# EAGLE design sw-4416-project-v1 (EAGLE 6.2)
ECE 4416 Design Project: Wireless Control Utilizing Head Movement
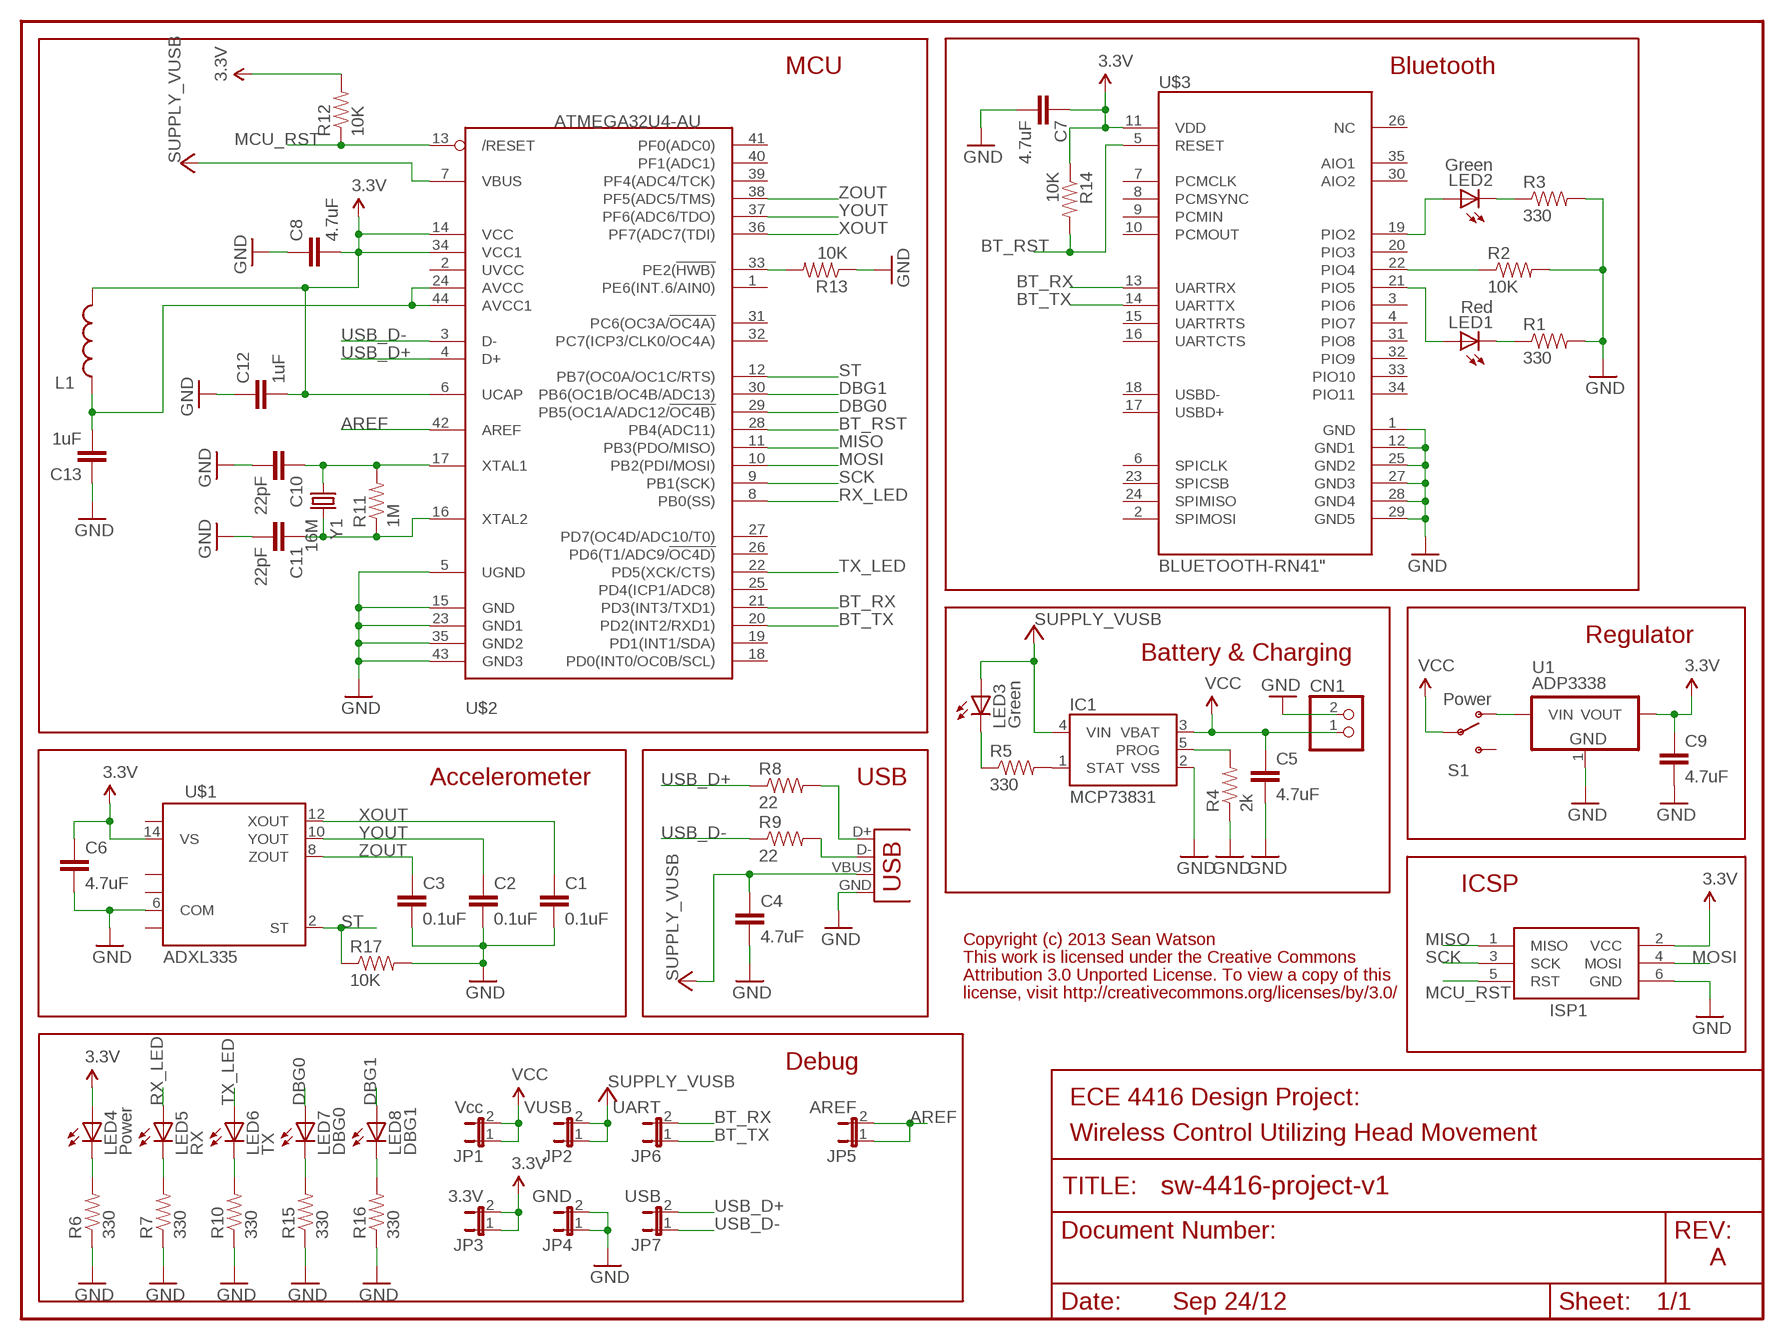
[diagram p0: schematic, sheet 1]
FRAME1 (FRAME-LETTER): LAST_DATE_TIME: Sep 20/12

## Parts
C1  0.1uF  CAP0603-CAP  [0603-CAP]
C2  0.1uF  CAP0603-CAP  [0603-CAP]
C3  0.1uF  CAP0603-CAP  [0603-CAP]
C4  4.7uF  CAP0603-CAP  [0603-CAP]
C5  4.7uF  CAP0603-CAP  [0603-CAP]
C6  4.7uF  CAP0603-CAP  [0603-CAP]
C7  4.7uF  CAP0603-CAP  [0603-CAP]
C8  4.7uF  CAP0603-CAP  [0603-CAP]
C9  4.7uF  CAP0603-CAP  [0603-CAP]
C10  22pF  CAP0603-CAP  [0603-CAP]
C11  22pF  CAP0603-CAP  [0603-CAP]
C12  1uF  CAP0603-CAP  [0603-CAP]
C13  1uF  CAP0603-CAP  [0603-CAP]
CN1  JST_2PIN-SMT-RA  [JST-PH-2-SMT-RA]
IC1  MCP73831  [SOT23-5]
ISP1  AVRISP-6  [AVRISP]
JP1  Vcc  JUMPER-2PTH  [1X02]
JP2  VUSB  JUMPER-2PTH  [1X02]
JP3  3.3V  JUMPER-2PTH  [1X02]
JP4  GND  JUMPER-2PTH  [1X02]
JP5  AREF  JUMPER-2PTH  [1X02]
JP6  UART  JUMPER-2PTH  [1X02]
JP7  USB  JUMPER-2PTH  [1X02]
L1  INDUCTOR0805  [0805]
LED1  Red  LED0603  [LED-0603]
LED2  Green  LED0603  [LED-0603]
LED3  Green  LED0603  [LED-0603]
LED4  Power  LED0603  [LED-0603]
LED5  RX  LED0603  [LED-0603]
LED6  TX  LED0603  [LED-0603]
LED7  DBG0  LED0603  [LED-0603]
LED8  DBG1  LED0603  [LED-0603]
R1  330  RESISTOR0603-RES  [0603-RES]
R2  10K  RESISTOR0603-RES  [0603-RES]
R3  330  RESISTOR0603-RES  [0603-RES]
R4  2k  RESISTOR0603-RES  [0603-RES]
R5  330  RESISTOR0603-RES  [0603-RES]
R6  330  RESISTOR0603-RES  [0603-RES]
R7  330  RESISTOR0603-RES  [0603-RES]
R8  22  RESISTOR0603-RES  [0603-RES]
R9  22  RESISTOR0603-RES  [0603-RES]
R10  330  RESISTOR0603-RES  [0603-RES]
R11  1M  RESISTOR0603-RES  [0603-RES]
R12  10K  RESISTOR0603-RES  [0603-RES]
R13  10K  RESISTOR0603-RES  [0603-RES]
R14  10K  RESISTOR0603-RES  [0603-RES]
R15  330  RESISTOR0603-RES  [0603-RES]
R16  330  RESISTOR0603-RES  [0603-RES]
R17  10K  RESISTOR0603-RES  [0603-RES]
S1  Power  SWITCH-SPST-SMD-A  [SWITCH-SPST-SMD-A]
U1  ADP3338  VREG_3PINS-SOT-223  [SOT-223]
U$1  ADXL335  [LFCSP-16]
U$2  ATMEGA32U4-AU  [TQFP44]
U$3  BLUETOOTH-RN41"  [RN41]
X1  USB-MICROB  [USB-MICROB]
Y1  16M  CRYSTALHC49US  [HC49US]

## Nets
3.3V: C6.1 C7.1 C8.2 C9.1 C12.2 ISP1.2(VCC) JP3.1 JP3.2 L1.2 LED4.A R12.2 R14.1 U1.2(VOUT) U$1.14(VS) U$2.6(UCAP) U$2.14(VCC) U$2.34(VCC1) U$3.11(VDD)
AREF: JP5.1 JP5.2 U$2.42(AREF)
BT_RST: R14.2 U$2.28(PB4(ADC11)) U$3.5(RESET)
BT_RX: JP6.2 U$2.21(PD3(INT3/TXD1)) U$3.13(UARTRX)
BT_TX: JP6.1 U$2.20(PD2(INT2/RXD1)) U$3.14(UARTTX)
DBG0: LED7.A U$2.29(PB5(OC1A/ADC12/!OC4B))
DBG1: LED8.A U$2.30(PB6(OC1B/OC4B/ADC13))
GND: C1.2 C2.2 C3.2 C4.2 C5.2 C6.2 C7.2 C8.1 C9.2 C10.2 C11.2 C12.1 C13.1 CN1.2 IC1.2(VSS) ISP1.6(GND) JP4.1 JP4.2 R1.2 R2.2 R3.2 R4.1 R6.1 R7.1 R10.1 R13.1 R15.1 R16.1 R17.2 U1.1(GND) U$1.6(COM) U$2.5(UGND) U$2.15(GND) U$2.23(GND1) U$2.35(GND2) U$2.43(GND3) U$3.1(GND) U$3.12(GND1) U$3.25(GND2) U$3.27(GND3) U$3.28(GND4) U$3.29(GND5) X1.GND
MCU_RST: ISP1.5(RST) R12.1 U$2.13(/RESET)
MISO: ISP1.1(MISO) U$2.11(PB3(PDO/MISO))
MOSI: ISP1.4(MOSI) U$2.10(PB2(PDI/MOSI))
N$1: LED2.C R3.1
N$2: LED1.C R1.1
N$3: R2.1 U$3.22(PIO4)
N$4: LED2.A U$3.19(PIO2)
N$5: LED1.A U$3.21(PIO5)
N$6: IC1.5(PROG) R4.2
N$7: IC1.1(STAT) R5.2
N$8: LED3.C R5.1
N$9: LED4.C R6.2
N$10: LED5.C R7.2
N$12: LED6.C R10.2
N$13: C10.1 R11.2 U$2.17(XTAL1) Y1.1
N$14: C11.1 R11.1 U$2.16(XTAL2) Y1.2
N$15: R8.2 X1.D+
N$16: LED7.C R15.2
N$17: C13.2 L1.1 U$2.24(AVCC) U$2.44(AVCC1)
N$18: LED8.C R16.2
N$19: R13.2 U$2.33(PE2(!HWB))
N$20: R9.2 X1.D-
RX_LED: LED5.A U$2.8(PB0(SS))
SCK: ISP1.3(SCK) U$2.9(PB1(SCK))
ST: R17.1 U$1.2(ST) U$2.12(PB7(OC0A/OC1C/RTS))
TX_LED: LED6.A U$2.22(PD5(XCK/CTS))
USB_D+: JP7.2 R8.1 U$2.4(D+)
USB_D-: JP7.1 R9.1 U$2.3(D-)
VCC: C5.1 CN1.1 IC1.3(VBAT) JP1.1 JP1.2 S1.2(P)
VIN: S1.1(O) U1.3(VIN)
VUSB: C4.1 IC1.4(VIN) JP2.1 JP2.2 LED3.A U$2.7(VBUS) X1.VBUS ; supply symbol labelled SUPPLY_VUSB
XOUT: C1.1 U$1.12(XOUT) U$2.36(PF7(ADC7(TDI))
YOUT: C2.1 U$1.10(YOUT) U$2.37(PF6(ADC6/TDO))
ZOUT: C3.1 U$1.8(ZOUT) U$2.38(PF5(ADC5/TMS))
Unconnected: S1.3(S) U$1.3(COM) U$1.5(COM) U$1.7(COM) U$1.15(VS) U$2.1(PE6(INT.6/AIN0)) U$2.2(UVCC) U$2.18(PD0(INT0/OC0B/SCL)) U$2.19(PD1(INT1/SDA)) U$2.25(PD4(ICP1/ADC8)) U$2.26(PD6(T1/ADC9/!OC4D)) U$2.27(PD7(OC4D/ADC10/T0)) U$2.31(PC6(OC3A/!OC4A)) U$2.32(PC7(ICP3/CLK0/OC4A)) U$2.39(PF4(ADC4/TCK)) U$2.40(PF1(ADC1)) U$2.41(PF0(ADC0)) U$3.2(SPIMOSI) U$3.3(PIO6) U$3.4(PIO7) U$3.6(SPICLK) U$3.7(PCMCLK) U$3.8(PCMSYNC) U$3.9(PCMIN) U$3.10(PCMOUT) U$3.15(UARTRTS) U$3.16(UARTCTS) U$3.17(USBD+) U$3.18(USBD-) U$3.20(PIO3) U$3.23(SPICSB) U$3.24(SPIMISO) U$3.26(NC) U$3.30(AIO2) U$3.31(PIO8) U$3.32(PIO9) U$3.33(PIO10) U$3.34(PIO11) U$3.35(AIO1)

## Notes on the sheet
- MCU | Bluetooth
- Regulator
- Battery & Charging
- Accelerometer | USB
- ICSP
- Copyright (c) 2013 Sean Watson
- This work is licensed under the Creative Commons
- Attribution 3.0 Unported License. To view a copy of this
- license, visit http://creativecommons.org/licenses/by/3.0/
- Debug
- ECE 4416 Design Project:
- Wireless Control Utilizing Head Movement
- A
- Sep 24/12

## Library data of the parts
C1-C13 = SparkFun:CAP: Capacitor Standard 0603 ceramic capacitor, and 0.1" leaded capacitor.
CN1 = adafruit:JST_2PIN: JST 2-Pin Connectors of various flavors SMT-RA (S2B-PH-SM4) 4UConnector #17311 SMT (B2B-PH-SM4) THM-RA (S2B-PH) THM (B2B-PH)
IC1 = SparkFun:MCP73831: Microchip's MCP73831 Miniature single cell, fully integrated Li-Ion, Li-polymer charge management controller http://ww1.microchip.com/downloads/en/DeviceDoc/21984a.pdf
ISP1 = adafruit:AVRISP: AVR ISP HEADER Standard 6 pin header for AVR programming
JP1-JP7 = SparkFun:JUMPER-2: Jumper Basic 0.1" spaced jumper. Use with breakaway headers.
L1 = SparkFun:INDUCTOR: Inductors Basic Inductor/Choke - 0603 and 1206. Footprints are not proven and vary greatly between part numbers.
LED1-LED8 = SparkFun:LED: LEDs Standard schematic elements and footprints for 5mm, 3mm, 1206, and 0603 sized LEDs. 5mm - Spark Fun Electronics SKU : COM-00529 (and others)
R1-R17 = SparkFun:RESISTOR: Resistor Basic schematic elements and footprints for 0603, 1206, and PTH resistors.
S1 = SparkFun:SWITCH-SPST: SPST Switch Simple slide switch. Spark Fun Electronics SKU : COM-00102
U1 = dp_devices:VREG_3PINS: Various 3 pin voltage regulators in different packages Double check the right pinout for the right part
U$1 = SparkFun:ADXL335
U$2 = adafruit:ATMEGA32U4: http://www.ladyada.net/library/eagle
U$3 = SparkFun:BLUETOOTH-RN41
X1 = SparkFun:USB: USB Connectors USB-B-PTH is fully proven SKU : PRT-00139 USB-miniB is fully proven SKU : PRT-00587 USB-A-PCB is untested. USB-A-H is throughly reviewed, but untested. Spark Fun Electronics SKU : PRT-00437 USB-B-SMT is throughly reviewed, but untested. Needs silkscreen touching up. USB-A-S has not been used/tested USB-MB-H has not been used/tested
Y1 = SparkFun:CRYSTAL: Crystals Various standard crystals. Proven footprints. Spark Fun Electronics SKU : COM-00534

## Board
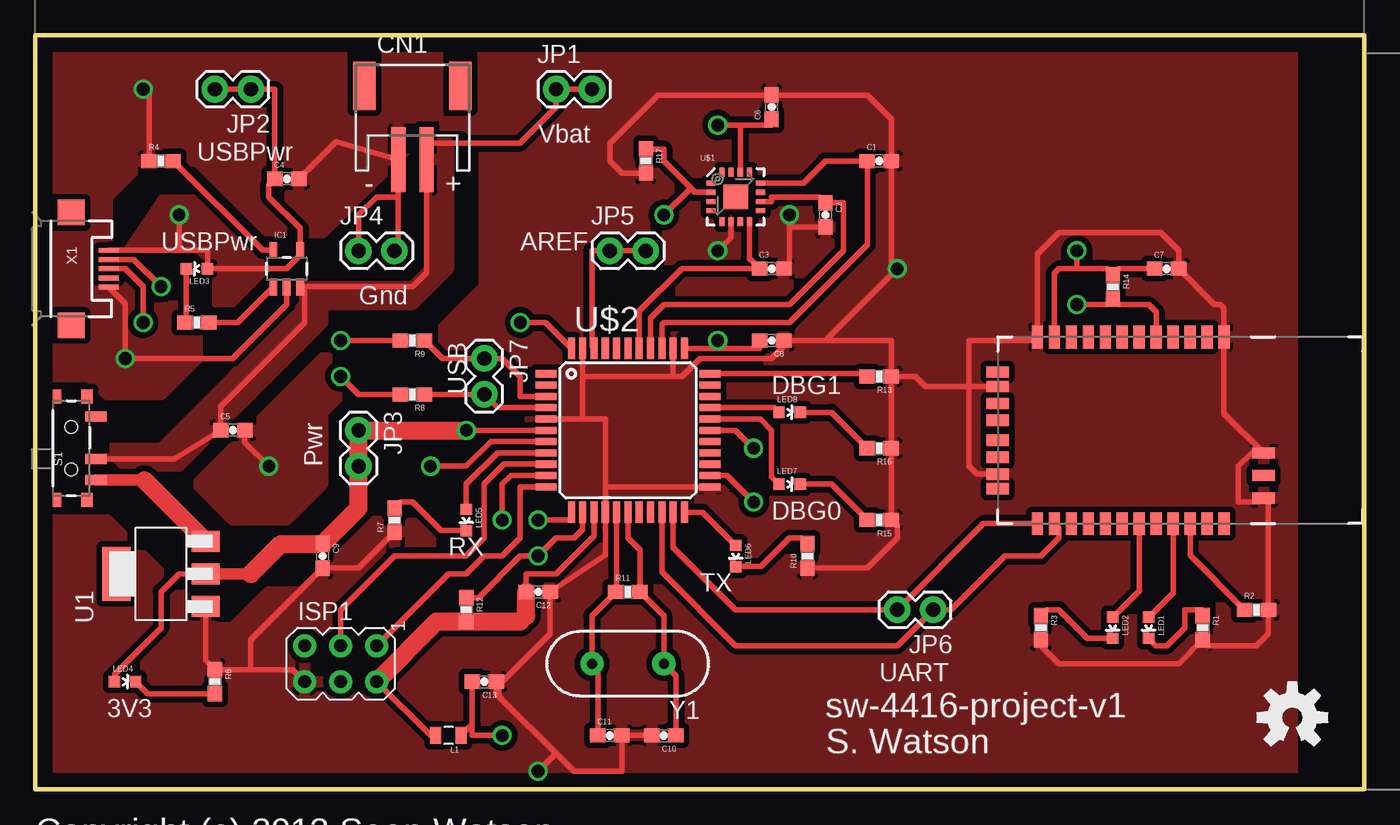
[diagram p1: board, top side]
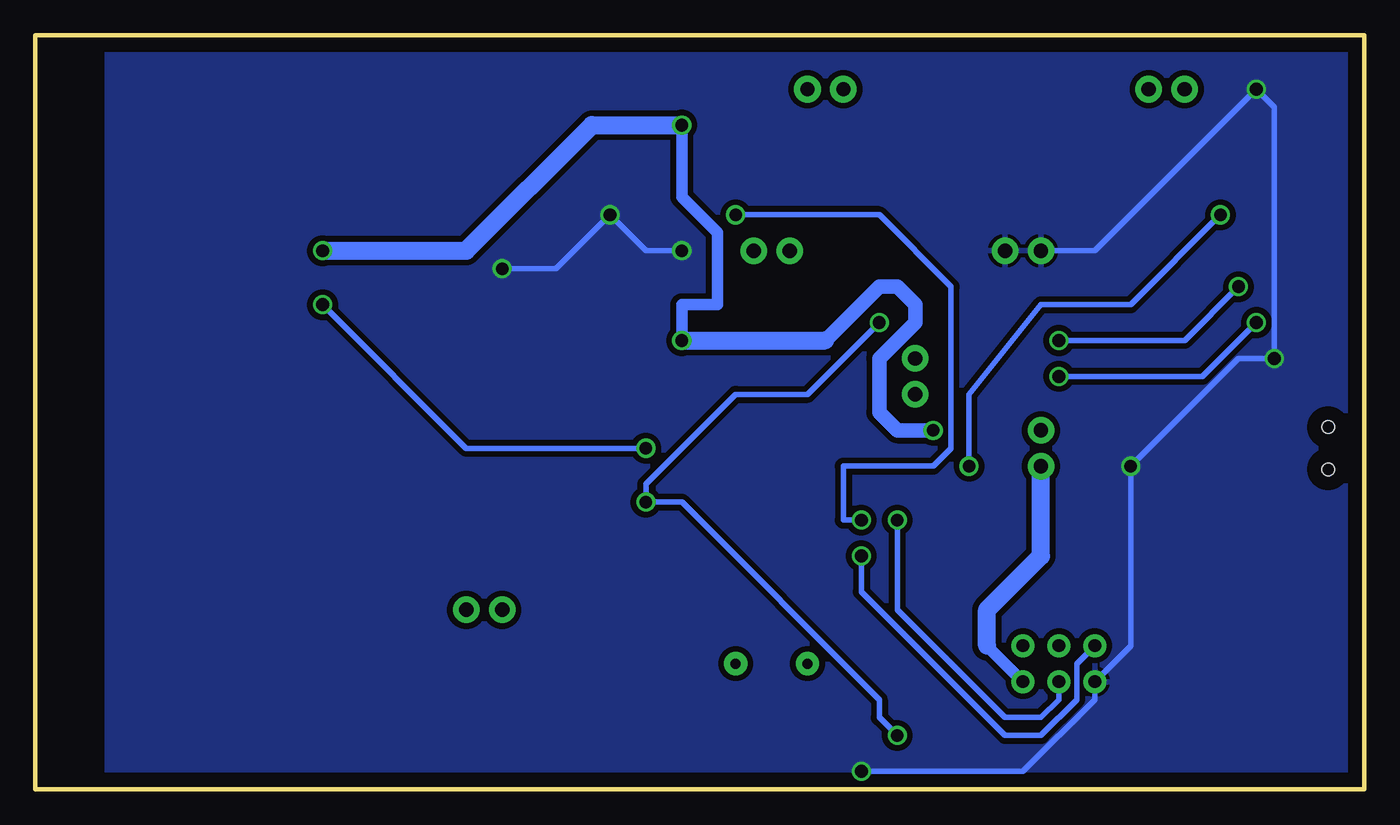
[diagram p2: board, bottom side, seen from below]

Size 93.98 x 53.34 mm. Coordinates in mm from the lower left corner, seen from the top.
Outline: 0,53.34 0,0 93.98,0 93.98,53.34 0,53.34
Copper layers (1*16): Top 0.035mm / dielectric 1.5mm / Bottom 0.035mm
Design rules: minimum track width 16mil, minimum drill 24mil, track to track 16mil, track to pad 16mil, pad to pad 16mil, via to via 16mil, smd to smd 16mil, copper to edge 40mil, drill to drill 16mil, minimum pad ring 10mil, minimum via ring 8mil, stop-mask expansion 4mil, vias tented up to drill 0mil, thermal gap 10mil

### Footprints (pad centres in the part's own frame; a part is rotated, then mirrored left to right if it is on the bottom)
0603-CAP = smd 1.1 x 1: 1 -0.85,0; 2 0.85,0
JST-PH-2-SMT-RA = smd 1 x 4.6: 1 1,-3.7; 2 -1,-3.7 | smd 1.6 x 3.4: NC1 -3.4,1.5; NC2 3.4,1.5
SOT23-5 = smd 0.55 x 1.2: 1 -0.95,-1.3; 2 0,-1.3; 3 0.95,-1.3; 4 0.95,1.3; 5 -0.95,1.3
AVRISP = drill 0.9 pad 1.626: 1 -1.27,2.54; 2 1.27,2.54; 3 -1.27,0; 4 1.27,0; 5 -1.27,-2.54; 6 1.27,-2.54
1X02 = drill 1.016 pad 1.88: 1 0,0; 2 2.54,0
0805 = smd 0.8 x 1.2: 1 -0.9,0; 2 0.9,0
LED-0603 = smd 0.8 x 0.8: A 0,-0.75; C 0,0.75
0603-RES = smd 1.1 x 1: 1 -0.85,0; 2 0.85,0
SWITCH-SPST-SMD-A = smd 0.7 x 1.5: 1 -2.25,-1.75; 2 -0.75,-1.75; 3 2.25,-1.75 | smd 1 x 0.6: GND1 -3.65,1; GND3 3.65,1 | smd 1 x 0.8: GND2 -3.65,-1.1; GND4 3.65,-1.1 | hole 0.9: -1.5,0; 1.5,0
SOT-223 = smd 1.5 x 2: 1 -2.3,-3.15; 2 0,-3.15; 3 2.3,-3.15 | smd 3.8 x 2: 4 0,3.15
LFCSP-16 = smd 1.75 x 1.75: 0 0,0 | smd 0.65 x 0.37: 1 -1.75,0.975; 2 -1.75,0.325; 3 -1.75,-0.325; 4 -1.75,-0.975; 9 1.75,-0.975; 10 1.75,-0.325; 11 1.75,0.325; 12 1.75,0.975 | smd 0.37 x 0.65: 5 -0.975,-1.75; 6 -0.325,-1.75; 7 0.325,-1.75; 8 0.975,-1.75; 13 0.975,1.75; 14 0.325,1.75; 15 -0.325,1.75; 16 -0.975,1.75
TQFP44 = smd 1.5 x 0.5: 1 -5.8,4; 2 -5.8,3.2; 3 -5.8,2.4; 4 -5.8,1.6; 5 -5.8,0.8; 6 -5.8,0; 7 -5.8,-0.8; 8 -5.8,-1.6; 9 -5.8,-2.4; 10 -5.8,-3.2; 11 -5.8,-4; 23 5.8,-4; 24 5.8,-3.2; 25 5.8,-2.4; 26 5.8,-1.6; 27 5.8,-0.8; 28 5.8,0; 29 5.8,0.8; 30 5.8,1.6; 31 5.8,2.4; 32 5.8,3.2; 33 5.8,4 | smd 0.5 x 1.5: 12 -4,-5.8; 13 -3.2,-5.8; 14 -2.4,-5.8; 15 -1.6,-5.8; 16 -0.8,-5.8; 17 0,-5.8; 18 0.8,-5.8; 19 1.6,-5.8; 20 2.4,-5.8; 21 3.2,-5.8; 22 4,-5.8; 34 4,5.8; 35 3.2,5.8; 36 2.4,5.8; 37 1.6,5.8; 38 0.8,5.8; 39 0,5.8; 40 -0.8,5.8; 41 -1.6,5.8; 42 -2.4,5.8; 43 -3.2,5.8; 44 -4,5.8
RN41 = smd 0.8 x 1.6: 1 -6.6,-6.6; 2 -5.4,-6.6; 3 -4.2,-6.6; 4 -3,-6.6; 5 -1.8,-6.6; 6 -0.6,-6.6; 7 0.6,-6.6; 8 1.8,-6.6; 9 3,-6.6; 10 4.2,-6.6; 11 5.4,-6.6; 12 6.6,-6.6; 13 6.6,6.6; 14 5.4,6.6; 15 4.2,6.6; 16 3,6.6; 17 1.8,6.6; 18 0.6,6.6; 19 -0.6,6.6; 20 -1.8,6.6; 21 -3,6.6; 22 -4.2,6.6; 23 -5.4,6.6; 24 -6.6,6.6 | smd 1.6 x 0.8: 25 -9.4,4.8; 26 -9.4,3.2; 27 -9.4,1.6; 28 9.4,3.1; 29 9.4,-3.1; 30 9.4,-4.122; 31 9.4,-1.9; 32 9.4,-0.7; 33 9.4,0.7; 34 9.4,1.9; 35 9.4,4.122
USB-MICROB = smd 0.35 x 1.4: D+ 0,2.65; D- -0.65,2.65; GND 1.3,2.65; ID 0.65,2.65; VBUS -1.3,2.65 | smd 1.8 x 1.9: MT1 -4,0; MT2 4,0
HC49US = drill 0.7 pad 1.651: 1 -2.54,0; 2 2.54,0

### Placement (x,y rotation side)
C1  59.69,44.45 0 top
C2  55.88,40.64 270 top
C3  52.07,36.83 0 top
C4  17.78,43.18 0 top
C5  13.97,25.4 0 top
C6  52.07,48.26 90 top
C7  80.01,36.83 0 top
C8  52.07,31.75 180 top
C9  20.32,16.51 270 top
C10  44.45,3.81 180 top
C11  40.64,3.81 0 top
C12  35.56,13.97 180 top
C13  31.75,7.62 180 top
CN1  26.67,48.26 0 top
IC1  17.78,36.83 0 top
ISP1  21.59,8.89 270 top
JP1  36.83,49.53 0 top
JP2  15.24,49.53 180 top
JP3  22.86,25.4 270 top
JP4  22.86,38.1 0 top
JP5  40.64,38.1 0 top
JP6  63.5,12.7 180 top
JP7  31.75,30.48 270 top
L1  29.21,3.81 180 top
LED1  78.74,11.43 180 top
LED2  76.2,11.43 180 top
LED3  11.43,36.83 90 top
LED4  6.35,7.62 270 top
LED5  30.48,19.05 180 top
LED6  49.53,16.51 180 top
LED7  53.34,21.59 270 top
LED8  53.34,26.67 270 top
R1  82.55,11.43 270 top
R2  86.36,12.7 0 top
R3  71.12,11.43 270 top
R4  8.89,44.45 0 top
R5  11.43,33.02 0 top
R6  12.7,7.62 270 top
R7  25.4,19.05 90 top
R8  26.67,27.94 180 top
R9  26.67,31.75 180 top
R10  54.61,16.51 90 top
R11  41.91,13.97 0 top
R12  30.48,12.7 270 top
R13  59.69,29.21 180 top
R14  76.2,35.56 270 top
R15  59.69,19.05 180 top
R16  59.69,24.13 180 top
R17  43.18,44.45 270 top
S1  2.54,24.13 90 top
U1  8.89,15.24 90 top
U$1  49.53,41.91 0 top
U$2  41.91,25.4 0 top
U$3  77.47,25.4 180 top
U$4  [OSHW-LOGO-M]  88.9,5.08 0 top
X1  2.54,36.83 270 top
Y1  41.91,8.89 180 top

### Tracks (layer width: path | path; a pad name or v marks a point on that pad's centre or on a via)
3.3V  (via drill 0.9)
  Top 0.406: U1.2 10.16,15.24 8.89,13.97 8.89,11.43 5.6,8.14 LED4.A | C7.1 76.62,36.83 R14.1 75.78,36.83 73.66,36.83 | 49.85,45.19 U$1.14 49.85,46.99 | ISP1.2 27.94,3.81 L1.2 | C8.2 51.22,31.2 U$2.34 48.26,31.2 v48.26,31.75 | v30.48,25.4 U$2.6 | 34.29,11.85 34.71,12.27 | C12.2 34.71,15.24 36.83,15.24 39.51,17.92 U$2.14 | 49.85,46.99 v48.26,46.99 | C6.1 52.07,46.99 49.85,46.99 | U$3.11 72.07,36.51 72.39,36.83 73.66,36.83 | 73.66,36.83 v73.66,38.1
  Top 0.813: U1.2 15.24,15.24
  Top 1.27: 15.24,15.24 17.36,17.36 C9.1 22.86,19.9 JP3.2 JP3.1 v30.48,25.4 | 34.29,11.85 R12.2 28.36,11.85 ISP1.2 | 34.71,12.27 C12.2
  Bottom 0.813: ISP1.2 26.67,10.16 | v48.26,31.75 48.26,34.29 45.72,34.29 45.72,39.37 48.26,41.91 v48.26,46.99
  Bottom 1.016: 38.1,31.75 34.29,35.56 33.02,35.56 31.75,34.29 31.75,33.02 34.29,30.48 34.29,26.67 33.02,25.4 v30.48,25.4
  Bottom 1.27: 26.67,10.16 26.67,12.7 22.86,16.51 JP3.2 | v48.26,31.75 38.1,31.75 | v73.66,38.1 63.5,38.1 54.61,46.99 v48.26,46.99
AREF
  Top 0.406: U$2.42 39.37,31.34 39.37,38.1 JP5.1 JP5.2
BT_RST  (via drill 0.9)
  Top 0.406: U$3.5 79.27,33.76 78.74,34.29 76.62,34.29 R14.2 75.78,34.29 v73.66,34.29 | U$2.28 49.53,25.4 v50.8,24.13
  Bottom 0.406: v50.8,24.13 63.5,24.13 v73.66,34.29
BT_RX
  Top 0.406: U$3.13 67.06,18.8 JP6.2 49.53,12.7 45.11,17.12 U$2.21
BT_TX
  Top 0.406: U$2.20 44.31,15.38 49.53,10.16 60.96,10.16 JP6.1 64.77,12.7 68.58,16.51 71.12,16.51 72.39,17.78 72.39,18.48 U$3.14
DBG0
  Top 0.406: U$2.29 51.27,26.2 52.07,25.4 52.07,22.11 LED7.A
DBG1
  Top 0.406: U$2.30 52.26,27 LED8.A
GND  (via drill 0.9)
  Top 0.406: U1.1 12.04,9.13 R6.1 15.24,8.47 | R13.1 R16.1 R15.1 60.96,18.63 60.96,17.78 58.84,15.66 R10.1 | U$3.29 66.04,28.5 | 66.04,28.5 62.94,28.5 62.23,29.21 R13.1 | R3.2 71.12,10.16 72.39,8.89 80.86,8.89 R1.2 82.97,10.16 86.36,10.16 87.21,11.01 R2.2 87.21,20.26 U$3.25 86.59,20.32 85.09,20.32 85.09,22.86 86.03,23.8 U$3.27 84.07,26.6 U$3.1 84.07,34.04 83.82,34.29 83.4,34.29 C7.2 80.86,38.1 79.59,39.37 72.39,39.37 70.87,37.85 U$3.12 70.62,31.75 66.04,31.75 66.04,28.5 | C4.2 21.28,45.83 CN1.2 25.67,41.91 | 25.67,41.91 25.67,38.37 JP4.2 | JP4.1 22.86,40.64 24.13,41.91 25.67,41.91 | 33.02,7.62 C13.1 32.6,6.77 33.02,6.35 | C10.2 C11.2 41.49,1.27 38.1,1.27 36.83,2.54 | ISP1.6 18.2,8.47 15.24,8.47 | 15.24,8.47 15.24,10.58 C9.2 22.86,15.66 R7.1 | R4.1 8.04,49.11 v7.62,49.53 | X1.GND 6.35,34.37 v6.35,30.48 13.97,30.48 17.78,34.29 IC1.2 | C5.2 14.82,24.55 v16.51,22.86 | R17.2 41.49,43.6 40.64,44.45 40.64,45.72 44.03,49.11 C6.2 58.84,49.11 60.54,47.41 C1.2 60.54,37.25 v60.96,36.83 55.88,31.75 | 40.31,21.59 40.31,26.2 U$2.5 38.71,26.2 U$2.43 38.71,29.21 45.11,29.21 | 40.31,21.59 U$2.15 40.31,16.6 C12.1 36.41,11.01 33.02,7.62 | C3.2 53.34,37.25 53.34,39.79 | 53.34,39.79 v53.34,40.64 | 55.88,31.75 C8.1 52.92,31.33 52.07,30.48 46.99,30.48 45.72,29.21 45.11,29.21 | 55.88,31.75 60.54,31.75 R13.1 | C2.2 53.34,39.79 | 33.02,7.62 arc90 33.02,6.35 | 33.02,6.35 36.83,2.54 | 36.83,2.54 v35.56,1.27 | U$2.23 40.5,21.4 arc-90 40.31,21.59 | 45.11,29.87 U$2.35 45.11,29.21 | U$1.6 49.2,39.05 v48.26,38.1 | U$3.28 66.6,22.3 66.04,22.86 66.04,28.5
  Bottom 0.406: JP4.1 19.05,38.1 v7.62,49.53 6.35,48.26 v6.35,30.48 8.89,30.48 v16.51,22.86 16.51,10.16 ISP1.6 19.05,6.35 24.13,1.27 v35.56,1.27 | v60.96,36.83 57.15,36.83 v53.34,40.64 50.8,38.1 v48.26,38.1
  pour Bottom: 0,53.34 0,0 88.9,0 88.9,53.34
  pour Top: 1.27,19.05 1.27,0 88.9,0 88.9,52.07 1.27,52.07 1.27,29.21 3.81,29.21 5.08,27.94 8.89,27.94 11.43,30.48 11.43,35.56 5.08,35.56 5.08,41.91 7.62,44.45 11.43,44.45 16.51,39.37 20.32,39.37 27.94,46.99 30.48,46.99 31.75,45.72 31.75,35.56 27.94,31.75 22.86,31.75 21.59,31.75 11.43,21.59 13.97,19.05 17.78,19.05 20.32,21.59 20.32,26.67 21.59,27.94 24.13,27.94 25.4,26.67 25.4,20.32 19.05,13.97 16.51,13.97 13.97,11.43 12.7,11.43 5.08,19.05
MCU_RST  (via drill 0.9)
  Top 0.406: R12.1 31.33,13.55 34.29,16.51 v35.56,16.51 36.83,17.78 38.1,17.78 38.71,18.39 U$2.13
  Bottom 0.406: ISP1.5 20.32,8.89 20.32,6.35 22.86,3.81 25.4,3.81 35.56,13.97 v35.56,16.51
MISO
  Top 0.406: ISP1.1 29.21,15.24 30.48,15.24 31.75,16.51 33.02,16.51 34.29,17.78 34.29,21.4 U$2.11
MOSI  (via drill 0.9)
  Top 0.406: v33.02,19.05 33.02,21.59 33.63,22.2 U$2.10
  Bottom 0.406: ISP1.4 21.59,6.35 22.86,5.08 25.4,5.08 33.02,12.7 v33.02,19.05
N$1
  Top 0.406: R3.1 71.54,12.7 72.39,12.7 74.41,10.68 LED2.C
N$2
  Top 0.406: LED1.C 79.26,10.16 80.01,10.16 81.28,11.43 81.28,12.7 82.55,12.7 R1.1
N$3
  Top 0.406: R2.1 81.67,16.54 U$3.22
N$4
  Top 0.406: LED2.A 78.07,14.05 U$3.19
N$5
  Top 0.406: LED1.A 80.47,13.91 U$3.21
N$6
  Top 0.406: IC1.5 16.06,38.13 R4.2
N$7
  Top 0.406: R5.2 14.32,33.02 IC1.1
N$8
  Top 0.406: LED3.C 10.68,33.12 R5.1
N$9
  Top 0.406: LED4.C 7.95,6.77 R6.2
N$10
  Top 0.406: LED5.C 28.69,18.3 26.67,20.32 25.82,20.32 R7.2
N$12
  Top 0.406: LED6.C 51.32,15.76 53.34,17.78 54.19,17.78 R10.2
N$13
  Top 0.406: U$2.17 41.91,17.78 42.76,16.93 R11.2 44.45,12.28 Y1.1 45.3,8.04 C10.1
N$14
  Top 0.406: U$2.16 41.11,13.97 R11.1 39.37,12.28 Y1.2 39.79,8.47 C11.1
N$15  (via drill 0.9)
  Top 0.406: X1.D+ 6.35,36.83 7.62,35.56 v7.62,33.02 | v21.59,29.21 22.86,27.94 R8.2
  Bottom 0.406: v7.62,33.02 11.43,29.21 v21.59,29.21
N$16
  Top 0.406: LED7.C 56.3,21.59 R15.2
N$17  (via drill 0.9)
  Top 0.406: L1.1 30.9,4.6 | 30.9,4.6 30.9,3.81 v33.02,3.81 | 30.9,4.6 C13.2 | U$2.24 48.92,22.2 v50.8,20.32 | v34.29,33.02 36.09,33.02 U$2.44
  Bottom 0.406: v33.02,3.81 34.29,5.08 34.29,6.35 48.26,20.32 v50.8,20.32 50.8,21.59 44.45,27.94 39.37,27.94 v34.29,33.02
N$18
  Top 0.406: LED8.C 56.3,26.67 R16.2
N$19
  Top 0.406: U$2.33 58.65,29.4 R13.2
N$20  (via drill 0.9)
  Top 0.406: X1.D- 6.97,37.48 v8.89,35.56 | v21.59,31.75 R9.2
  Bottom 0.406: v8.89,35.56 12.7,31.75 v21.59,31.75
RX_LED
  Top 0.406: LED5.A 30.48,21.59 32.69,23.8 U$2.8
SCK
  Top 0.406: U$2.9 33.16,23 31.75,21.59 31.75,17.78 30.48,16.51 25.4,16.51 21.59,12.7 ISP1.3
ST  (via drill 0.9)
  Top 0.406: U$1.2 46.66,42.23 46.35,42.55 | 46.35,42.55 44.45,44.45 44.45,45.3 R17.1 | v44.45,40.64 46.35,42.55 | v35.56,19.05 37.91,19.05 U$2.12
  Bottom 0.406: v44.45,40.64 34.29,40.64 29.21,35.56 29.21,24.13 30.48,22.86 36.83,22.86 36.83,19.05 v35.56,19.05
TX_LED
  Top 0.406: U$2.22 47.19,19.6 LED6.A
USB_D+
  Top 0.406: R8.1 JP7.2 32.69,27 U$2.4
USB_D-
  Top 0.406: R9.1 28.79,30.48 JP7.1 33.02,30.48 34.29,29.21 34.29,27.8 U$2.3
VCC
  Top 0.406: S1.2 9.83,23.38 C5.1 13.12,27.09 19.05,33.02 19.05,35.21 IC1.3 18.76,35.56 26.67,35.56 27.67,36.56 CN1.1 27.78,45.72 34.29,45.72 36.83,48.26 JP1.1 JP1.2
  pour Top: 5.08,24.13 8.89,24.13 19.05,34.29 19.05,35.56 26.67,35.56 27.94,36.83 27.94,45.72 29.21,45.72 29.21,36.83 26.67,34.29 20.32,34.29 20.32,33.02 10.16,22.86 6.35,22.86
VIN
  Top 0.813: S1.1 7.7,21.88
  Top 1.27: 7.7,21.88 U1.3
VUSB  (via drill 0.9)
  Top 0.406: JP2.2 JP2.1 16.93,49.53 C4.1 16.51,42.76 16.51,41.91 18.73,39.69 IC1.4 18.73,37.78 17.78,36.83 LED3.A 12.18,38.13 10.16,38.13 | 10.16,38.13 X1.VBUS | v10.16,40.64 10.16,38.13 | v27.94,22.86 30.48,22.86 32.22,24.6 U$2.7
  Bottom 0.406: v27.94,22.86 27.94,27.94 22.86,34.29 16.51,34.29 v10.16,40.64
  pour Top: 6.35,38.1 8.89,41.91 11.43,41.91 16.51,36.83 13.97,34.29 12.7,34.29 12.7,36.83 11.43,38.1
XOUT
  Top 0.406: U$1.12 54.31,42.89 55.88,44.45 C1.1 58.84,38.52 53.34,33.02 44.45,33.02 44.31,32.88 U$2.36
YOUT
  Top 0.406: U$2.37 43.51,33.35 44.45,34.29 53.34,34.29 57.15,38.1 57.15,41.49 C2.1 55.46,41.91 52.07,41.91 52.07,41.58 U$1.10
ZOUT
  Top 0.406: U$1.8 50.51,37.55 C3.1 45.72,36.83 42.71,33.82 U$2.38

### Text on the board
tNames: Copyright (c) 2013 Sean Watson | This work is licensed under the Creative Commons Attribution 3.0 Unported License | To view a copy of this license, visit http://creativecommons.org/licenses/by/3.0/.
tSilk: Vbat | USBPwr | USBPwr | AREF | Gnd | USB | DBG1 | Pwr | DBG0 | RX | TX | UART | 3V3
_tsilk: sw-4416-project-v1 | S. Watson